# EAGLE schematic passive RC high pass filter (EAGLE 6.2)
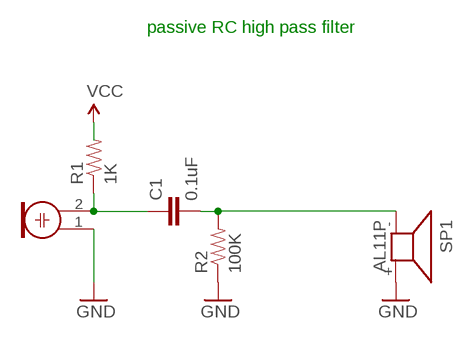
[diagram p0: schematic, sheet 1]

## Parts
C1  0.1uF  CAPPTH2  [CAP-PTH-SMALL2]
M1  ELECTRET_MICROPHON-F6050AP  [F6050AP]
R1  1K  RESISTORAXIAL-0.3  [AXIAL-0.3]
R2  100K  RESISTORAXIAL-0.3  [AXIAL-0.3]
SP1  AL11P  [AL11P]

## Nets
GND: M1.1 R2.P$1 SP1.+
N$1: C1.1 M1.2 R1.P$1
N$2: C1.2 R2.P$2 SP1.-
Unconnected: R1.P$2

## Notes on the sheet
- passive RC high pass filter

## Library data of the parts
C1 = SparkFun-Passives:CAP: Capacitor Standard 0603 ceramic capacitor, and 0.1" leaded capacitor.
M1 = microphon:ELECTRET_MICROPHON-: Electret Condenser Microphone
R1 R2 = SparkFun-Passives:RESISTOR: Resistor Basic schematic elements and footprints for 0603, 1206, and PTH resistors.
SP1 = buzzer:AL11P: SPEAKER Source: Buerklin; OC_FARNELL: unknown; OC_NEWARK: unknown